# EAGLE board BEP33_6panel (EAGLE 7.7.0), part 1 of 4
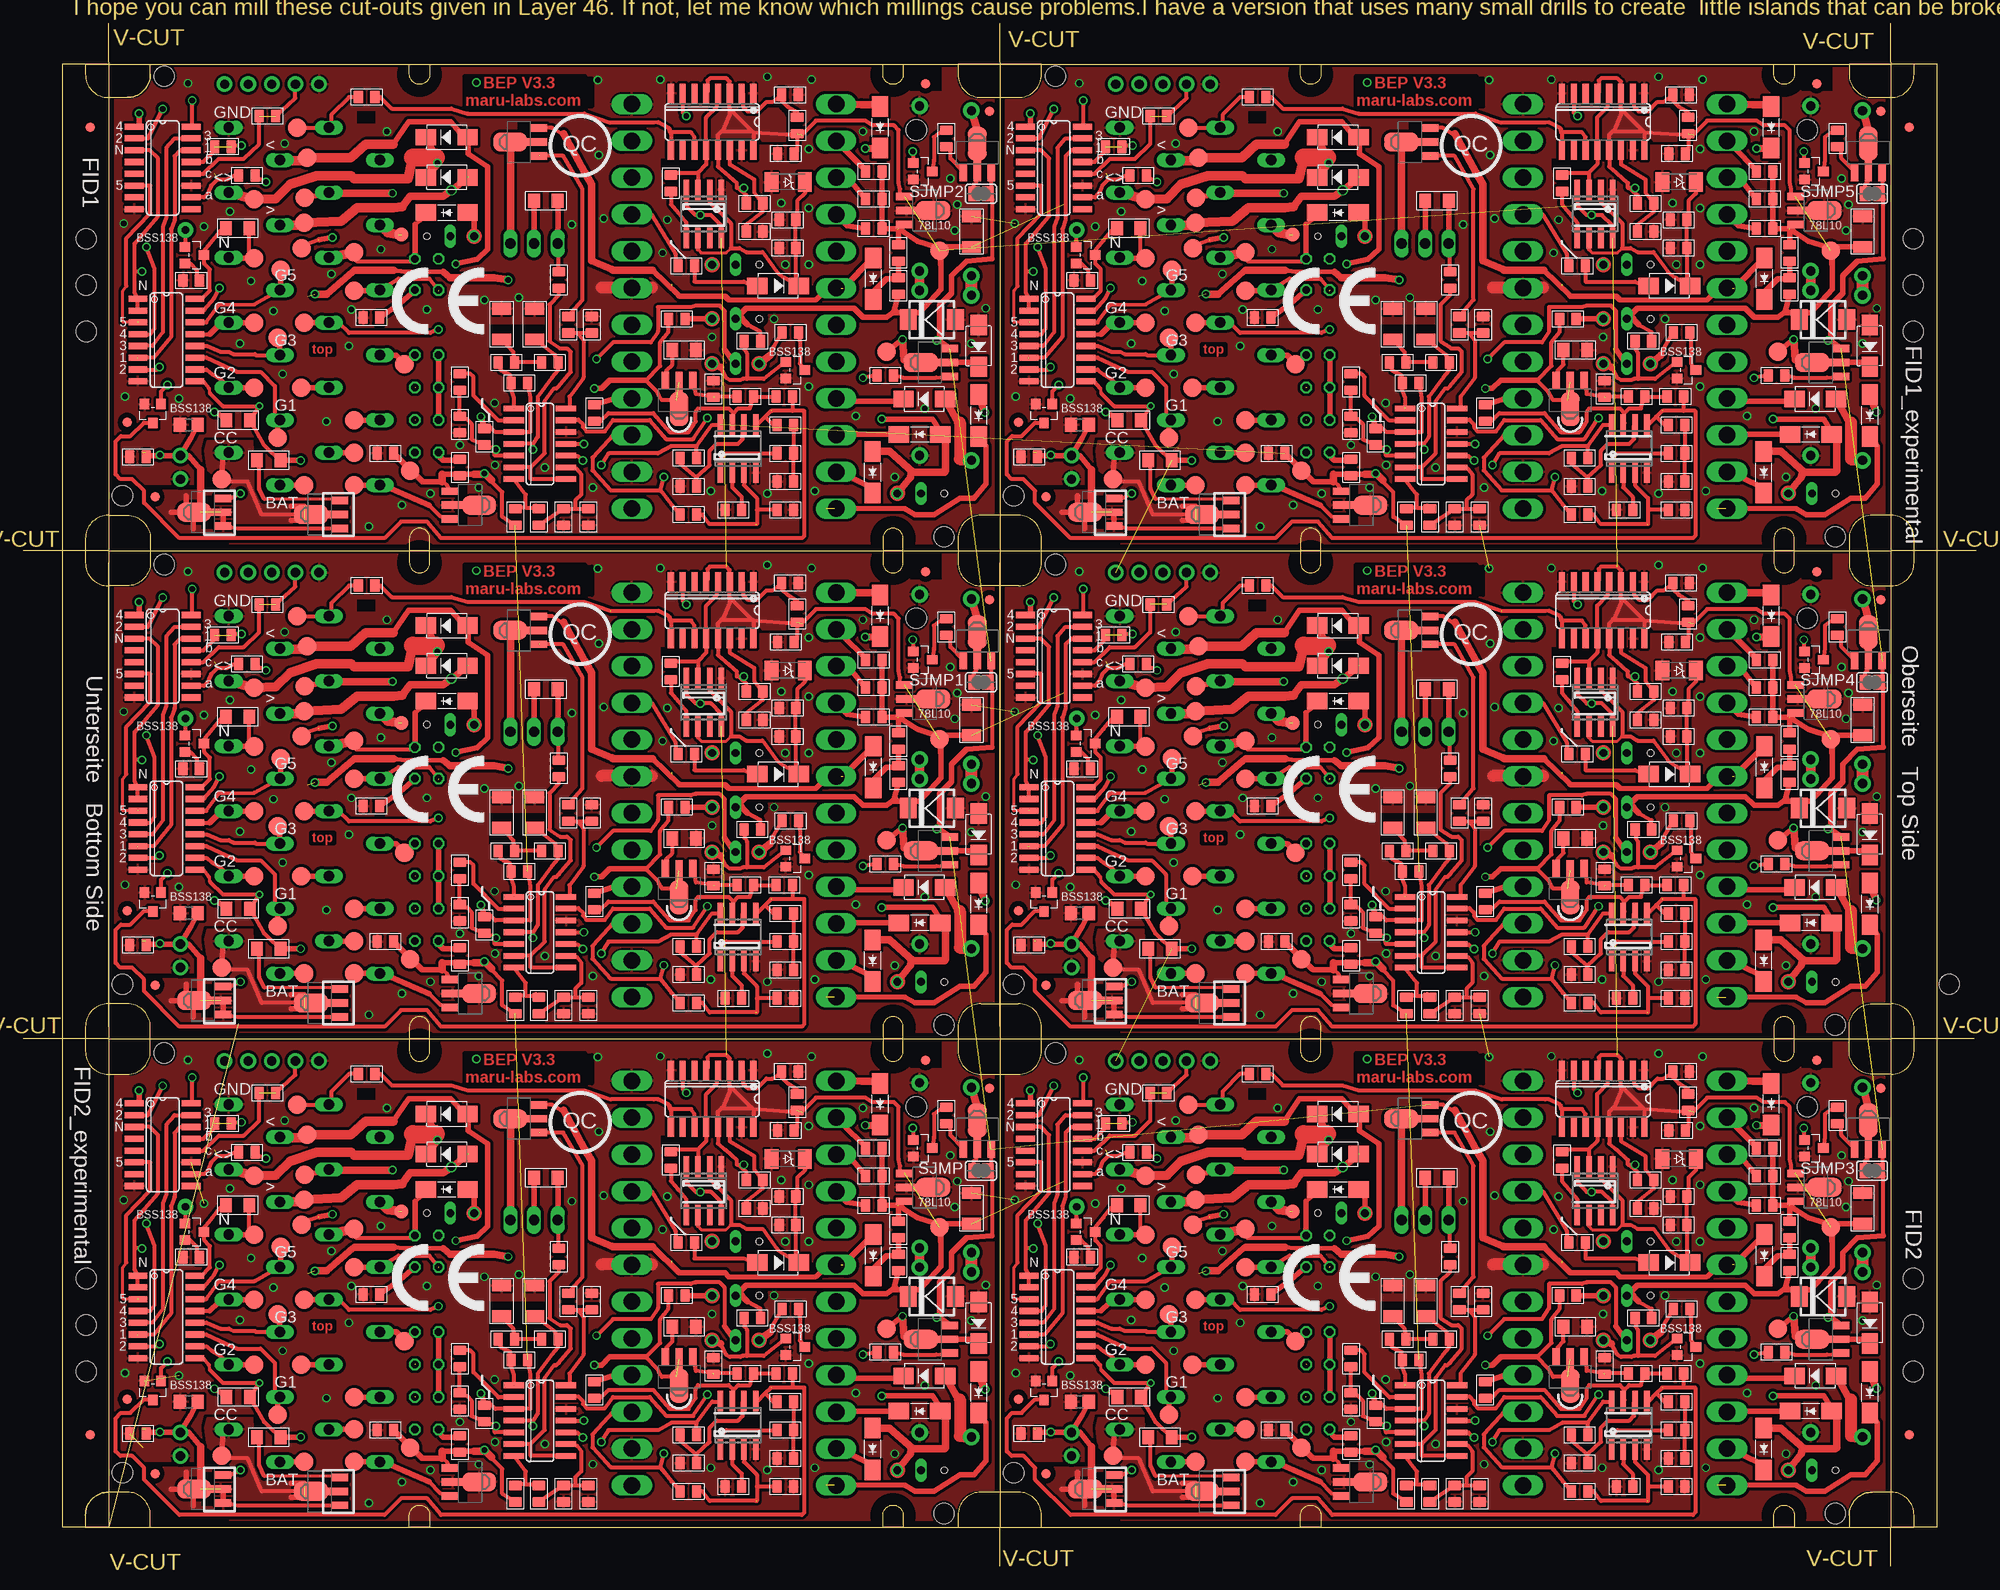
[diagram p13: board, top side]
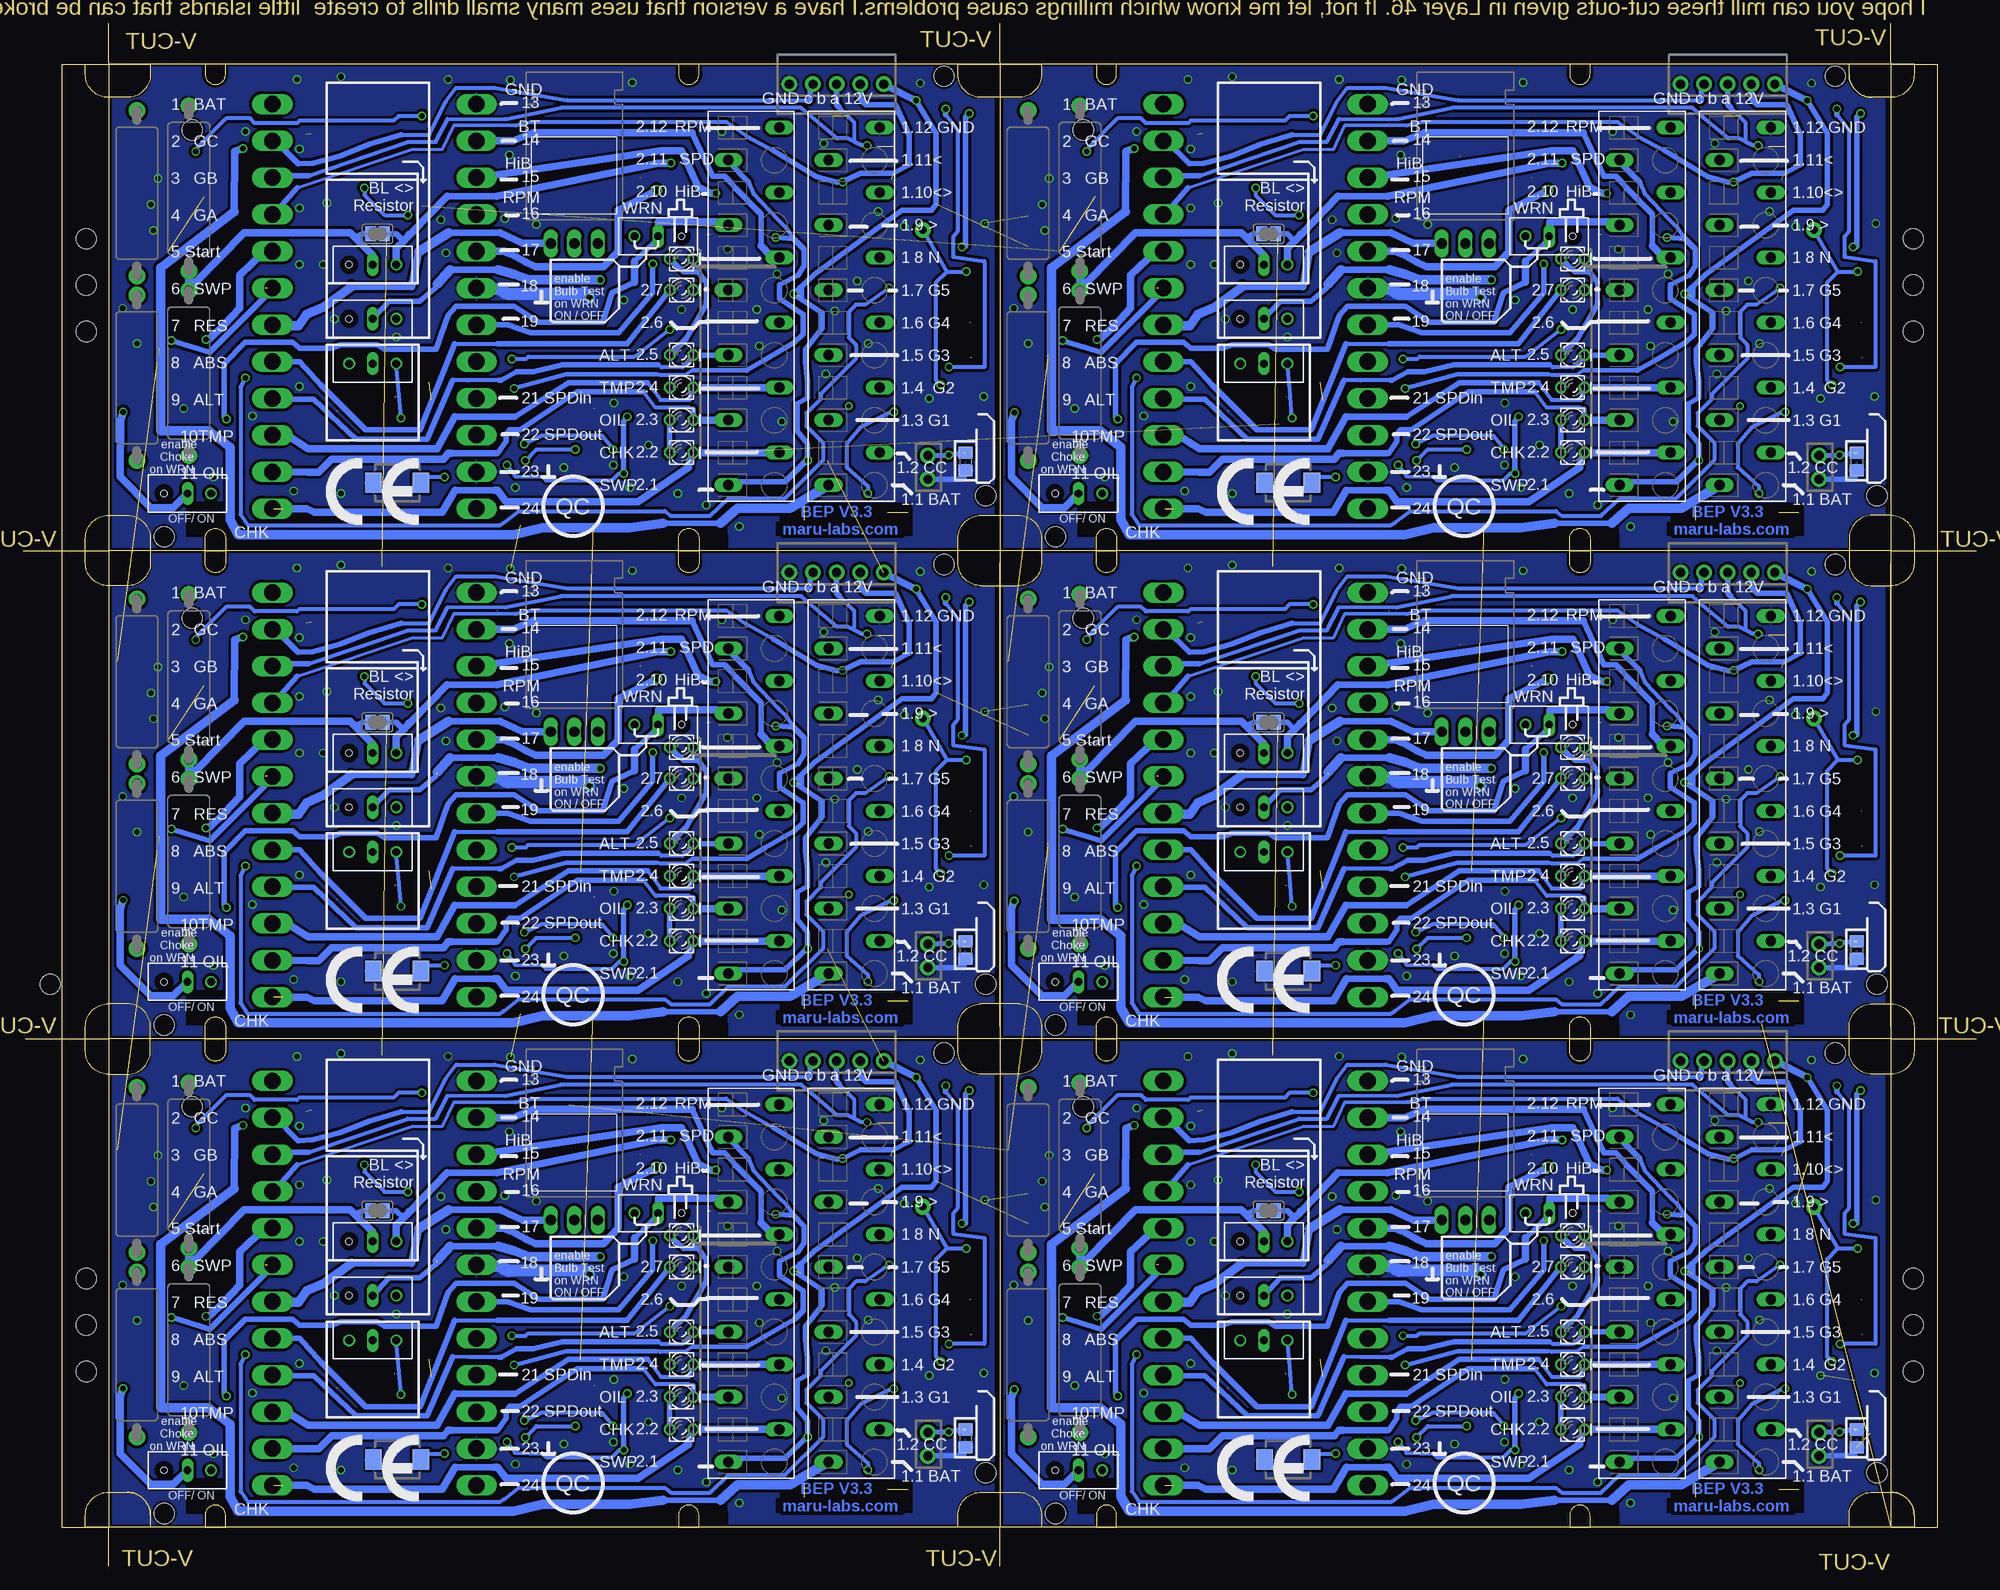
[diagram p14: board, bottom side, seen from below]

Size 210.4 x 166.2 mm. Coordinates in mm from the lower left corner, seen from the top.
Outline: 46 segments
Copper layers (1*16): Top 0.035mm / dielectric 1.5mm / Bottom 0.035mm
Design rules "Vorlage BEP3 und hoeher multi-cb_035um-cu": minimum track width 6mil, minimum drill 12mil, track to track 12mil, track to pad 12mil, pad to pad 6mil, via to via 6mil, smd to smd 6mil, copper to edge 10mil, drill to drill 8mil, minimum pad ring 8mil, minimum via ring 6mil, stop-mask expansion 3mil, vias tented up to drill 0mil, thermal gap 8mil
Holes 2.18 mm at 10.7,10.1 96.2,49.5 99.2,5.7 15.2,55.3 6.8,143 6.8,21 6.8,26 6.8,138 207.5,62.7 203.6,143 203.6,21 203.6,26 203.6,138 6.8,31 6.8,133 203.6,133 203.6,31 10.7,62.7 96.2,102.1 99.2,58.3 15.2,107.9 10.7,115.3 96.2,154.7 99.2,110.9 15.2,160.5 106.7,10.1 192.2,49.5 195.2,5.7 111.2,55.3 106.7,62.7 192.2,102.1 195.2,58.3 111.2,107.9 106.7,115.3 192.2,154.7 195.2,110.9 111.2,160.5
tRestrict: area 50.2,25.2 to 56.7,28.5; area 36,50.2 to 37.9,51.5; area 67.6,20.8 to 69.4,22.8; area 53.3,46.1 to 54.7,50.4; area 46.5,6.9 to 47.8,11.4; area 19.2,6.6 to 20.6,10.1; area 97.6,26.6 to 99.2,27.8; area 95.6,53.7 to 98.9,56.4; area 68.7,45.2 to 72.9,46.4; area 22.6,38.2 to 23.7,39.9; area 16.5,56.8 to 91.2,56.8; area 47.6,52 to 61.3,55.1; 96 more areas
bRestrict: area 18.6,5.8 to 28.8,9.3; area 28.7,5.8 to 33.3,7.3; area 38.5,5.1 to 45,7.3; area 90.8,5.7 to 96.8,9.5; area 41.5,54.3 to 43.9,56.7; area 41.3,55.4 to 44.1,56.8; area 92.5,54.3 to 94.9,56.7; area 92.3,55.4 to 95.1,56.8; area 92.4,4.2 to 95,6.8; area 41.4,4.2 to 44,6.9; area 38.5,4.2 to 45.6,5.9; area 100.8,53.1 to 105,56.8; 72 more areas
Milling: 188 lines

## Footprints (pad centres in the part's own frame; a part is rotated, then mirrored left to right if it is on the bottom)
12-PIN = drill 1.118 long: 1 19.25,-2.45; 2 15.75,3.05; 3 12.25,-2.45; 4 8.75,3.05; 5 5.25,-2.45; 6 1.75,3.05; 7 -1.75,-2.45; 8 -5.25,3.05; 9 -8.75,-2.45; 10 -12.25,3.05; 11 -15.75,-2.45; 12 -19.25,3.05
B2.0 = smd 2 x 2: TP 0,0
C1206 = smd 1.27 x 2.032: 1 -1.651,0; 2 1.651,0
C0805 = smd 1.397 x 1.016: 1 0,0.889; 2 0,-0.889
DO-214AC_SLIM = smd 2.2 x 1.77: 1 -2.242,0; 2 2.242,0
DO-214AC = smd 2.2 x 1.77: 1 -2.242,0; 2 2.242,0
SOD-123_MINI-SMA = smd 1.5 x 2.1: A 1.8,0; C -1.8,0
DO214AA = smd 1.8 x 2.2: A 2.55,0; C -2.55,0
DO214AA_BI = smd 1.8 x 2.2: A 2.45,0; C -2.65,0
FIDUCIAL_1MM = smd 1 x 1: 1 0,0
FIDUCIAL_1MM_WITH_SOLDERMASK = smd 1 x 1: 1 0,0
SO16 = smd 0.66 x 2.032: 1 -4.445,-3.073; 2 -3.175,-3.073; 3 -1.905,-3.073; 4 -0.635,-3.073; 5 0.635,-3.073; 6 1.905,-3.073; 7 3.175,-3.073; 8 4.445,-3.073; 9 4.445,3.073; 10 3.175,3.073; 11 1.905,3.073; 12 0.635,3.073; 13 -0.635,3.073; 14 -1.905,3.073; 15 -3.175,3.073; 16 -4.445,3.073
TO220H_NOHOLE = drill 1.118 long: 1 -2.54,-10.16; 2 0,-10.16; 3 2.54,-10.16
SO14 = smd 0.6 x 2.2: 1 -3.81,-2.8; 2 -2.54,-2.8; 3 -1.27,-2.8; 4 0,-2.8; 5 1.27,-2.8; 6 2.54,-2.8; 7 3.81,-2.8; 8 3.81,2.8; 9 2.54,2.8; 10 1.27,2.8; 11 0,2.8; 12 -1.27,2.8; 13 -2.54,2.8; 14 -3.81,2.8
SOT89_ROUND = smd 0.8 x 1.8: 1 -1.499,-2.181; 3 1.499,-2.181 | smd 0.8 x 2.3: 2 0,-1.927 | smd 2.032 x 3.65: 2@1 0,0.94
SO08 = smd 0.6 x 2.2: 1 -1.905,-2.6; 2 -0.635,-2.6; 3 0.635,-2.6; 4 1.905,-2.6; 5 1.905,2.6; 6 0.635,2.6; 7 -0.635,2.6; 8 -1.905,2.6
JP2_SMALLPADS = drill 0.85: 1 -2.54,0 | drill 0.85 long: 2 0,0 | hole 0.7: 2.54,0
JP2_ORIG_SMALLPADS = drill 0.85: 1 -2.54,0; 3 2.54,0 | drill 0.85 long: 2 0,0
LD260 = drill 0.813 octagon: A -1.27,0; K 1.27,0
SOT-23 = smd 1.016 x 1.143: 1 -0.889,-1.016; 2 0.889,-1.016; 3 0,1.016
SOT89 = smd 0.8 x 1.8: 1 -1.499,-2.181; 3 1.499,-2.181 | smd 0.8 x 2.3: 2 0,-1.927 | smd 2.032 x 3.65: 2@1 0,0.94
R0805 = smd 1.397 x 1.016: 1 0,0.889; 2 0,-0.889
R1206 = smd 1.27 x 1.524: 1 -1.27,0; 2 1.27,0
V235/17_1MM = drill 1 pad 1.778: 1 -8.89,0; 2 8.89,0
R0805' = smd 1.3 x 1.5: 1 -0.95,0; 2 0.95,0
SJ = smd 1.2 x 1.6: 1 -0.725,0; 2 0.725,0
SJ' = smd 1.168 x 1.6: 1 -0.762,0; 2 0.762,0
B1,27 = smd 1.5 x 1.5: TP 0,0
24-PIN_V2 = drill 1.778 long: 1 -21.78,-11; 2 -17.82,-11; 3 -13.86,-11; 4 -9.9,-11; 5 -5.94,-11; 6 -1.98,-11; 7 1.98,-11; 8 5.94,-11; 9 9.9,-11; 10 13.86,-11; 11 17.82,-11; 12 21.78,-11; 13 -21.78,11; 14 -17.82,11; 15 -13.86,11; 16 -9.9,11; 17 -5.94,11; 18 -1.98,11; 19 1.98,11; 20 5.94,11; 21 9.9,11; 22 13.86,11; 23 17.82,11; 24 21.78,11
22-23-2051 = drill 1 pad 1.676: 1 -5.08,0; 2 -2.54,0; 3 0,0; 4 2.54,0; 5 5.08,0
22-23-2021 = drill 1 pad 1.676: 1 -1.27,0; 2 1.27,0

## Placement (x,y rotation side)
1  [12-PIN]  25.19,30.5 270 bottom
2  [12-PIN]  35.98,30.5 270 bottom
3  [12-PIN]  25.19,83.1 270 bottom
4  [12-PIN]  35.98,83.1 270 bottom
5  [12-PIN]  25.19,135.7 270 bottom
6  [12-PIN]  35.98,135.7 270 bottom
6V  TPSB2.0  [B2.0]  41.7,12.78 0 top
6V1  TPSB2.0  [B2.0]  41.7,65.38 0 top
6V2  TPSB2.0  [B2.0]  41.7,117.98 0 top
6V3  TPSB2.0  [B2.0]  137.7,12.78 0 top
6V4  TPSB2.0  [B2.0]  137.7,65.38 0 top
6V5  TPSB2.0  [B2.0]  137.7,117.98 0 top
7  [12-PIN]  121.19,30.5 270 bottom
8  [12-PIN]  131.98,30.5 270 bottom
9  [12-PIN]  121.19,83.1 270 bottom
10  [12-PIN]  131.98,83.1 270 bottom
10V  TPSB2.0  [B2.0]  98.7,36.5 0 top
10V1  TPSB2.0  [B2.0]  98.7,89.1 0 top
10V2  TPSB2.0  [B2.0]  98.7,141.7 0 top
10V3  TPSB2.0  [B2.0]  194.7,36.5 0 top
10V4  TPSB2.0  [B2.0]  194.7,89.1 0 top
10V5  TPSB2.0  [B2.0]  194.7,141.7 0 top
11  [12-PIN]  121.19,135.7 270 bottom
12  [12-PIN]  131.98,135.7 270 bottom
C1  100u  [C1206]  51.54,81.19 90 top
C2  10u  [C1206]  102.16,38.56 90 top
C3  100u  [C1206]  55.1,81.19 90 top
C4  100nF,  [C0805]  39.03,67.28 270 top
C5  4.7u  [C0805]  82.1,61.19 90 top
C6  100nF.  [C0805]  58.21,60.43 0 top
C7  100nF.  [C0805]  61.26,81.13 0 top
C8  2.2nF  [C0805]  82.34,89.38 90 top
C9  100nF  [C0805]  82.16,99.55 270 top
C10  100nF  [C0805]  78.78,91.16 90 top
C11  100nF,  [C0805]  82.1,64.24 270 top
C12  4.7u  [C0805]  82.61,105.89 270 top
C13  10u  [C1206]  102.16,91.16 90 top
C14  100u  [C1206]  51.54,133.79 90 top
C15  4.7u  [C0805]  82.61,53.29 270 top
C16  100u  [C1206]  55.1,133.79 90 top
C17  100nF,  [C0805]  39.03,119.88 270 top
C18  4.7u  [C0805]  82.1,113.79 90 top
C19  100nF.  [C0805]  58.21,113.03 0 top
C20  100nF.  [C0805]  61.26,133.73 0 top
C21  2.2nF  [C0805]  82.34,141.98 90 top
C22  100nF  [C0805]  82.16,152.15 270 top
C23  100nF  [C0805]  78.78,143.76 90 top
C24  100nF,  [C0805]  82.1,116.84 270 top
C25  4.7u  [C0805]  82.61,158.49 270 top
C26  10u  [C1206]  102.16,143.76 90 top
C27  100u  [C1206]  147.54,28.59 90 top
C28  100u  [C1206]  151.1,28.59 90 top
C29  100nF,  [C0805]  135.03,14.68 270 top
C30  4.7u  [C0805]  178.1,8.59 90 top
C31  100nF.  [C0805]  154.21,7.83 0 top
C32  100nF.  [C0805]  157.26,28.53 0 top
C33  2.2nF  [C0805]  178.34,36.78 90 top
C34  100nF  [C0805]  178.16,46.95 270 top
C35  100nF  [C0805]  174.78,38.56 90 top
C36  100nF,  [C0805]  178.1,11.64 270 top
C37  4.7u  [C0805]  178.61,53.29 270 top
C38  10u  [C1206]  198.16,38.56 90 top
C39  100u  [C1206]  147.54,81.19 90 top
C40  100u  [C1206]  151.1,81.19 90 top
C41  100nF,  [C0805]  135.03,67.28 270 top
C42  4.7u  [C0805]  178.1,61.19 90 top
C43  100nF.  [C0805]  154.21,60.43 0 top
C44  100nF.  [C0805]  157.26,81.13 0 top
C45  2.2nF  [C0805]  178.34,89.38 90 top
C46  100nF  [C0805]  178.16,99.55 270 top
C47  100nF  [C0805]  174.78,91.16 90 top
C48  100nF,  [C0805]  178.1,64.24 270 top
C49  4.7u  [C0805]  178.61,105.89 270 top
C50  10u  [C1206]  198.16,91.16 90 top
C51  100u  [C1206]  147.54,133.79 90 top
C52  100u  [C1206]  151.1,133.79 90 top
C53  100nF,  [C0805]  135.03,119.88 270 top
C54  4.7u  [C0805]  178.1,113.79 90 top
C55  100nF.  [C0805]  154.21,113.03 0 top
C56  100nF.  [C0805]  157.26,133.73 0 top
C57  2.2nF  [C0805]  178.34,141.98 90 top
C58  100nF  [C0805]  178.16,152.15 270 top
C59  100nF  [C0805]  174.78,143.76 90 top
C60  100nF,  [C0805]  178.1,116.84 270 top
C61  4.7u  [C0805]  178.61,158.49 270 top
C62  10u  [C1206]  198.16,143.76 90 top
C101  4.7u  [C0805]  82.1,8.59 90 top
C102  100nF  [C0805]  82.16,46.95 270 top
C103  100nF,  [C0805]  82.1,11.64 270 top
C104  100nF,  [C0805]  39.03,14.68 270 top
C105  100nF.  [C0805]  58.21,7.83 0 top
C106  100nF.  [C0805]  61.26,28.53 0 top
C107  100u  [C1206]  51.54,28.59 90 top
C108  100u  [C1206]  55.1,28.59 90 top
C109  2.2nF  [C0805]  82.34,36.78 90 top
C110  100nF  [C0805]  78.78,38.56 90 top
D1  SS12  [DO-214AC_SLIM]  91.56,33.49 270 top
D2  SS12  [DO-214AC_SLIM]  92.3,49.78 270 top
D3  1N4007,  [DO-214AC]  45.64,97 180 top
D4  Zen11  [SOD-123_MINI-SMA]  82.4,43.88 180 top
D5  1N4007,  [DO-214AC]  45.64,101.32 180 top
D6  1N4007.  [DO-214AC]  97.07,73.13 180 top
D7  1N5817  [DO-214AC_SLIM]  96.56,69.32 180 top
D8  1N5817.  [DO-214AC_SLIM]  91.5,65.24 270 top
D9  1N5817.  [DO-214AC_SLIM]  102.93,71.35 270 top
D10  1N5817  [DO-214AC_SLIM]  45.64,93.19 180 top
D11  1N4007.  [DO-214AC]  102.93,78.84 270 top
D12  1N4007  [DO-214AC]  81.32,85.32 0 top
D13  Zen15  [DO214AA]  97.89,81.67 0 top
D14  SM6TDO214AA_BI  [DO214AA_BI]  74.21,64.11 180 bottom
D15  SS12  [DO-214AC_SLIM]  91.56,86.09 270 top
D16  SS12  [DO-214AC_SLIM]  92.3,102.38 270 top
D17  Zen11  [SOD-123_MINI-SMA]  82.4,96.48 180 top
D18  1N4007,  [DO-214AC]  45.64,149.6 180 top
D19  1N4007,  [DO-214AC]  45.64,153.92 180 top
D20  1N4007.  [DO-214AC]  97.07,125.73 180 top
D21  1N5817  [DO-214AC_SLIM]  96.56,121.92 180 top
D22  1N5817.  [DO-214AC_SLIM]  91.5,117.84 270 top
D23  1N5817.  [DO-214AC_SLIM]  102.93,123.95 270 top
D24  1N5817  [DO-214AC_SLIM]  45.64,145.79 180 top
D25  1N4007.  [DO-214AC]  102.93,131.44 270 top
D26  1N4007  [DO-214AC]  81.32,137.92 0 top
D27  Zen15  [DO214AA]  97.89,134.27 0 top
D28  SM6TDO214AA_BI  [DO214AA_BI]  74.21,116.71 180 bottom
D29  SS12  [DO-214AC_SLIM]  91.56,138.69 270 top
D30  SS12  [DO-214AC_SLIM]  92.3,154.98 270 top
D31  Zen11  [SOD-123_MINI-SMA]  82.4,149.08 180 top
D32  1N4007,  [DO-214AC]  141.64,44.4 180 top
D33  1N4007,  [DO-214AC]  141.64,48.72 180 top
D34  1N4007.  [DO-214AC]  193.07,20.53 180 top
D35  1N5817  [DO-214AC_SLIM]  192.56,16.72 180 top
D36  1N5817.  [DO-214AC_SLIM]  187.5,12.64 270 top
D37  1N5817.  [DO-214AC_SLIM]  198.93,18.75 270 top
D38  1N5817  [DO-214AC_SLIM]  141.64,40.59 180 top
D39  1N4007.  [DO-214AC]  198.93,26.24 270 top
D40  1N4007  [DO-214AC]  177.32,32.72 0 top
D41  Zen15  [DO214AA]  193.89,29.07 0 top
D42  SM6TDO214AA_BI  [DO214AA_BI]  170.21,11.51 180 bottom
D43  SS12  [DO-214AC_SLIM]  187.56,33.49 270 top
D44  SS12  [DO-214AC_SLIM]  188.3,49.78 270 top
D45  Zen11  [SOD-123_MINI-SMA]  178.4,43.88 180 top
D46  1N4007,  [DO-214AC]  141.64,97 180 top
D47  1N4007,  [DO-214AC]  141.64,101.32 180 top
D48  1N4007.  [DO-214AC]  193.07,73.13 180 top
D49  1N5817  [DO-214AC_SLIM]  192.56,69.32 180 top
D50  1N5817.  [DO-214AC_SLIM]  187.5,65.24 270 top
D51  1N5817.  [DO-214AC_SLIM]  198.93,71.35 270 top
D52  1N5817  [DO-214AC_SLIM]  141.64,93.19 180 top
D53  1N4007.  [DO-214AC]  198.93,78.84 270 top
D54  1N4007  [DO-214AC]  177.32,85.32 0 top
D55  Zen15  [DO214AA]  193.89,81.67 0 top
D56  SM6TDO214AA_BI  [DO214AA_BI]  170.21,64.11 180 bottom
D57  SS12  [DO-214AC_SLIM]  187.56,86.09 270 top
D58  SS12  [DO-214AC_SLIM]  188.3,102.38 270 top
D59  Zen11  [SOD-123_MINI-SMA]  178.4,96.48 180 top
D60  1N4007,  [DO-214AC]  141.64,149.6 180 top
D61  1N4007,  [DO-214AC]  141.64,153.92 180 top
D62  1N4007.  [DO-214AC]  193.07,125.73 180 top
D63  1N5817  [DO-214AC_SLIM]  192.56,121.92 180 top
D64  1N5817.  [DO-214AC_SLIM]  187.5,117.84 270 top
D65  1N5817.  [DO-214AC_SLIM]  198.93,123.95 270 top
D66  1N5817  [DO-214AC_SLIM]  141.64,145.79 180 top
D67  1N4007.  [DO-214AC]  198.93,131.44 270 top
D68  1N4007  [DO-214AC]  177.32,137.92 0 top
D69  Zen15  [DO214AA]  193.89,134.27 0 top
D70  SM6TDO214AA_BI  [DO214AA_BI]  170.21,116.71 180 bottom
D71  SS12  [DO-214AC_SLIM]  187.56,138.69 270 top
D72  SS12  [DO-214AC_SLIM]  188.3,154.98 270 top
D73  Zen11  [SOD-123_MINI-SMA]  178.4,149.08 180 top
D101  Zen15  [DO214AA]  97.89,29.07 0 top
D102  1N4007,  [DO-214AC]  45.64,44.4 180 top
D103  1N4007,  [DO-214AC]  45.64,48.72 180 top
D104  SM6TDO214AA_BI  [DO214AA_BI]  74.21,11.51 180 bottom
D105  1N4007.  [DO-214AC]  102.93,26.24 270 top
D106  1N4007.  [DO-214AC]  97.07,20.53 180 top
D107  1N5817  [DO-214AC_SLIM]  96.56,16.72 180 top
D108  1N5817.  [DO-214AC_SLIM]  91.5,12.64 270 top
D109  1N5817.  [DO-214AC_SLIM]  102.93,18.75 270 top
D110  1N5817  [DO-214AC_SLIM]  45.64,40.59 180 top
D112  1N4007  [DO-214AC]  81.32,32.72 0 top
FID1  FIDUCIAL  [FIDUCIAL_1MM]  7.2,155 0 top
FID1B  FIDUCIALFIDUCIAL_1MM_WITH_SOLDERMASK  [FIDUCIAL_1MM_WITH_SOLDERMASK]  203.2,155 0 top
FID2  FIDUCIAL  [FIDUCIAL_1MM]  203.2,14.2 0 top
FID2B  FIDUCIALFIDUCIAL_1MM_WITH_SOLDERMASK  [FIDUCIAL_1MM_WITH_SOLDERMASK]  7.2,14.2 0 top
FID3  FIDUCIAL  [FIDUCIAL_1MM]  97.2,107.1 0 top
FID4  FIDUCIAL  [FIDUCIAL_1MM]  11.2,70.6 0 top
FID5  FIDUCIAL  [FIDUCIAL_1MM]  14.2,62.6 0 top
FID6  FIDUCIAL  [FIDUCIAL_1MM]  104.1,104.1 0 top
FID7  FIDUCIAL  [FIDUCIAL_1MM]  97.2,159.7 0 top
FID8  FIDUCIAL  [FIDUCIAL_1MM]  11.2,123.2 0 top
FID9  FIDUCIAL  [FIDUCIAL_1MM]  14.2,115.2 0 top
FID10  FIDUCIAL  [FIDUCIAL_1MM]  104.1,156.7 0 top
FID11  FIDUCIAL  [FIDUCIAL_1MM]  193.2,54.5 0 top
FID12  FIDUCIAL  [FIDUCIAL_1MM]  107.2,18 0 top
FID13  FIDUCIAL  [FIDUCIAL_1MM]  110.2,10 0 top
FID14  FIDUCIAL  [FIDUCIAL_1MM]  200.1,51.5 0 top
FID15  FIDUCIAL  [FIDUCIAL_1MM]  193.2,107.1 0 top
FID16  FIDUCIAL  [FIDUCIAL_1MM]  107.2,70.6 0 top
FID17  FIDUCIAL  [FIDUCIAL_1MM]  110.2,62.6 0 top
FID18  FIDUCIAL  [FIDUCIAL_1MM]  200.1,104.1 0 top
FID19  FIDUCIAL  [FIDUCIAL_1MM]  193.2,159.7 0 top
FID20  FIDUCIAL  [FIDUCIAL_1MM]  107.2,123.2 0 top
FID21  FIDUCIAL  [FIDUCIAL_1MM]  110.2,115.2 0 top
FID22  FIDUCIAL  [FIDUCIAL_1MM]  200.1,156.7 0 top
FID101  FIDUCIAL  [FIDUCIAL_1MM]  97.2,54.5 0 top
FID102  FIDUCIAL  [FIDUCIAL_1MM]  11.2,18 0 top
FID103  FIDUCIAL  [FIDUCIAL_1MM]  14.2,10 0 top
FID104  FIDUCIAL  [FIDUCIAL_1MM]  104.1,51.5 0 top
IC1  4028  [SO16]  15.03,98.02 270 top
IC2  317TO202H_NOHOLE  [TO220H_NOHOLE]  55.03,100.05 0 bottom
IC3  ULN2004  [SO16]  15.43,79.48 270 top
IC4  LM339  [SO14]  55.67,68.3 270 top
IC5  78L06  [SOT89_ROUND]  48.18,61.7 270 top
IC6  555  [SO08]  73.32,93.06 180 top
IC7  4538  [SO16]  74.21,102.97 180 top
IC8  78L10  [SOT89_ROUND]  97.11,93.42 270 top
IC9  LM2904  [SO08]  77.01,67.79 0 top
IC10  4028  [SO16]  15.03,150.62 270 top
IC11  317TO202H_NOHOLE  [TO220H_NOHOLE]  55.03,152.65 0 bottom
IC12  ULN2004  [SO16]  15.43,132.08 270 top
IC13  LM339  [SO14]  55.67,120.9 270 top
IC14  78L06  [SOT89_ROUND]  48.18,114.3 270 top
IC15  555  [SO08]  73.32,145.66 180 top
IC16  4538  [SO16]  74.21,155.57 180 top
IC17  78L10  [SOT89_ROUND]  97.11,146.02 270 top
IC18  LM2904  [SO08]  77.01,120.39 0 top
IC19  4028  [SO16]  111.03,45.42 270 top
IC20  317TO202H_NOHOLE  [TO220H_NOHOLE]  151.03,47.45 0 bottom
IC21  ULN2004  [SO16]  111.43,26.88 270 top
IC22  LM339  [SO14]  151.67,15.7 270 top
IC23  78L06  [SOT89_ROUND]  144.18,9.1 270 top
IC24  555  [SO08]  169.32,40.47 180 top
IC25  4538  [SO16]  170.21,50.37 180 top
IC26  78L10  [SOT89_ROUND]  193.11,40.82 270 top
IC27  LM2904  [SO08]  173.01,15.19 0 top
IC28  4028  [SO16]  111.03,98.02 270 top
IC29  317TO202H_NOHOLE  [TO220H_NOHOLE]  151.03,100.05 0 bottom
IC30  ULN2004  [SO16]  111.43,79.48 270 top
IC31  LM339  [SO14]  151.67,68.3 270 top
IC32  78L06  [SOT89_ROUND]  144.18,61.7 270 top
IC33  555  [SO08]  169.32,93.06 180 top
IC34  4538  [SO16]  170.21,102.97 180 top
IC35  78L10  [SOT89_ROUND]  193.11,93.42 270 top
IC36  LM2904  [SO08]  173.01,67.79 0 top
IC37  4028  [SO16]  111.03,150.62 270 top
IC38  317TO202H_NOHOLE  [TO220H_NOHOLE]  151.03,152.65 0 bottom
IC39  ULN2004  [SO16]  111.43,132.08 270 top
IC40  LM339  [SO14]  151.67,120.9 270 top
IC41  78L06  [SOT89_ROUND]  144.18,114.3 270 top
IC42  555  [SO08]  169.32,145.66 180 top
IC43  4538  [SO16]  170.21,155.57 180 top
IC44  78L10  [SOT89_ROUND]  193.11,146.02 270 top
IC45  LM2904  [SO08]  173.01,120.39 0 top
IC101  LM2904  [SO08]  77.01,15.19 0 top
IC102  78L06  [SOT89_ROUND]  48.18,9.1 270 top
IC104  78L10  [SOT89_ROUND]  97.11,40.82 270 top
IC105  4028  [SO16]  15.03,45.42 270 top
IC107  ULN2004  [SO16]  15.43,26.88 270 top
IC108  LM339  [SO14]  55.67,15.7 270 top
IC109  317TO202H_NOHOLE  [TO220H_NOHOLE]  55.03,47.45 0 bottom
IC110  555  [SO08]  73.32,40.47 180 top
IC111  4538  [SO16]  74.21,50.37 180 top
JP1  [JP2_SMALLPADS]  76.75,81.76 180 bottom
JP2  JP2E_ORIG  [JP2_ORIG_SMALLPADS]  76.75,76.94 180 bottom
JP3  [JP2_SMALLPADS]  96.7,62.95 180 bottom
JP4  [JP2_SMALLPADS]  46.02,90.65 0 bottom
JP5  [JP2_SMALLPADS]  76.75,87.6 180 bottom
JP6  [JP2_SMALLPADS]  76.75,134.36 180 bottom
JP7  JP2E_ORIG  [JP2_ORIG_SMALLPADS]  76.75,129.54 180 bottom
JP8  [JP2_SMALLPADS]  96.7,115.55 180 bottom
JP9  [JP2_SMALLPADS]  46.02,143.25 0 bottom
JP10  [JP2_SMALLPADS]  76.75,140.2 180 bottom
JP11  [JP2_SMALLPADS]  172.75,29.16 180 bottom
JP12  JP2E_ORIG  [JP2_ORIG_SMALLPADS]  172.75,24.34 180 bottom
JP13  [JP2_SMALLPADS]  192.7,10.35 180 bottom
JP14  [JP2_SMALLPADS]  142.02,38.05 0 bottom
JP15  [JP2_SMALLPADS]  172.75,35 180 bottom
JP16  [JP2_SMALLPADS]  172.75,81.76 180 bottom
JP17  JP2E_ORIG  [JP2_ORIG_SMALLPADS]  172.75,76.94 180 bottom
JP18  [JP2_SMALLPADS]  192.7,62.95 180 bottom
JP19  [JP2_SMALLPADS]  142.02,90.65 0 bottom
JP20  [JP2_SMALLPADS]  172.75,87.6 180 bottom
JP21  [JP2_SMALLPADS]  172.75,134.36 180 bottom
JP22  JP2E_ORIG  [JP2_ORIG_SMALLPADS]  172.75,129.54 180 bottom
JP23  [JP2_SMALLPADS]  192.7,115.55 180 bottom
JP24  [JP2_SMALLPADS]  142.02,143.25 0 bottom
JP25  [JP2_SMALLPADS]  172.75,140.2 180 bottom
JP101  [JP2_SMALLPADS]  76.75,29.16 180 bottom
JP102  [JP2_SMALLPADS]  96.7,10.35 180 bottom
JP103  [JP2_SMALLPADS]  46.02,38.05 0 bottom
JP104  [JP2_SMALLPADS]  76.75,35 180 bottom
JP105  JP2E_ORIG  [JP2_ORIG_SMALLPADS]  76.75,24.34 180 bottom
LED1  [LD260]  43.48,67.35 0 bottom
LED2  [LD260]  43.48,70.85 0 bottom
LED3  [LD260]  43.48,74.35 0 bottom
LED4  [LD260]  43.48,77.85 0 bottom
LED5  [LD260]  43.48,84.85 0 bottom
LED6  [LD260]  43.48,88.22 0 bottom
LED7  [LD260]  43.48,119.95 0 bottom
LED8  [LD260]  43.48,123.45 0 bottom
LED9  [LD260]  43.48,126.95 0 bottom
LED10  [LD260]  43.48,130.45 0 bottom
LED11  [LD260]  43.48,137.45 0 bottom
LED12  [LD260]  43.48,140.82 0 bottom
LED13  [LD260]  139.48,14.75 0 bottom
LED14  [LD260]  139.48,18.25 0 bottom
LED15  [LD260]  139.48,21.75 0 bottom
LED16  [LD260]  139.48,25.25 0 bottom
LED17  [LD260]  139.48,32.25 0 bottom
LED18  [LD260]  139.48,35.62 0 bottom
LED19  [LD260]  139.48,67.35 0 bottom
LED20  [LD260]  139.48,70.85 0 bottom
LED21  [LD260]  139.48,74.35 0 bottom
LED22  [LD260]  139.48,77.85 0 bottom
LED23  [LD260]  139.48,84.85 0 bottom
LED24  [LD260]  139.48,88.22 0 bottom
LED25  [LD260]  139.48,119.95 0 bottom
LED26  [LD260]  139.48,123.45 0 bottom
LED27  [LD260]  139.48,126.95 0 bottom
LED28  [LD260]  139.48,130.45 0 bottom
LED29  [LD260]  139.48,137.45 0 bottom
LED30  [LD260]  139.48,140.82 0 bottom
LED101  [LD260]  43.48,32.25 0 bottom
LED102  [LD260]  43.48,14.75 0 bottom
LED103  [LD260]  43.48,18.25 0 bottom
LED104  [LD260]  43.48,21.75 0 bottom
LED105  [LD260]  43.48,25.25 0 bottom
LED106  [LD260]  43.48,35.62 0 bottom
Q1  J1  [SOT-23]  13.97,18.96 180 top
Q2  BA  [SOT89]  102.77,47.08 0 top
Q3  J1  [SOT-23]  96.9,45.05 270 top
Q4  BA  [SOT89]  97.64,77.06 90 top
Q5  BA.  [SOT89]  19.35,60.93 90 top
Q6  BA.  [SOT89]  31.93,60.68 90 top
Q7  BA  [SOT89]  53.38,100.81 90 top
Q8  MY  [SOT89]  70.66,73 180 top
Q9  J1  [SOT-23]  83.17,76.24 270 top
Q10  J1  [SOT-23]  18.46,88.62 270 top
Q11  J1  [SOT-23]  13.97,71.56 180 top
Q12  BA  [SOT89]  102.77,99.68 0 top
Q13  J1  [SOT-23]  96.9,97.65 270 top
Q14  BA  [SOT89]  97.64,129.66 90 top
Q15  BA.  [SOT89]  19.35,113.53 90 top
Q16  BA.  [SOT89]  31.93,113.28 90 top
Q17  BA  [SOT89]  53.38,153.41 90 top
Q18  MY  [SOT89]  70.66,125.6 180 top
Q19  J1  [SOT-23]  83.17,128.84 270 top
Q20  J1  [SOT-23]  18.46,141.22 270 top
Q21  J1  [SOT-23]  13.97,124.16 180 top
Q22  BA  [SOT89]  102.77,152.28 0 top
Q23  J1  [SOT-23]  96.9,150.25 270 top
Q24  BA  [SOT89]  193.64,24.46 90 top
Q25  BA.  [SOT89]  115.35,8.33 90 top
Q26  BA.  [SOT89]  127.93,8.08 90 top
Q27  BA  [SOT89]  149.38,48.21 90 top
Q28  MY  [SOT89]  166.66,20.4 180 top
Q29  J1  [SOT-23]  179.17,23.64 270 top
Q30  J1  [SOT-23]  114.46,36.02 270 top
Q31  J1  [SOT-23]  109.97,18.96 180 top
Q32  BA  [SOT89]  198.77,47.08 0 top
Q33  J1  [SOT-23]  192.9,45.05 270 top
Q34  BA  [SOT89]  193.64,77.06 90 top
Q35  BA.  [SOT89]  115.35,60.93 90 top
Q36  BA.  [SOT89]  127.93,60.68 90 top
Q37  BA  [SOT89]  149.38,100.81 90 top
Q38  MY  [SOT89]  166.66,73 180 top
Q39  J1  [SOT-23]  179.17,76.24 270 top
Q40  J1  [SOT-23]  114.46,88.62 270 top
Q41  J1  [SOT-23]  109.97,71.56 180 top
Q42  BA  [SOT89]  198.77,99.68 0 top
Q43  J1  [SOT-23]  192.9,97.65 270 top
Q44  BA  [SOT89]  193.64,129.66 90 top
Q45  BA.  [SOT89]  115.35,113.53 90 top
Q46  BA.  [SOT89]  127.93,113.28 90 top
Q47  BA  [SOT89]  149.38,153.41 90 top
Q48  MY  [SOT89]  166.66,125.6 180 top
Q49  J1  [SOT-23]  179.17,128.84 270 top
Q50  J1  [SOT-23]  114.46,141.22 270 top
Q51  J1  [SOT-23]  109.97,124.16 180 top
Q52  BA  [SOT89]  198.77,152.28 0 top
Q53  J1  [SOT-23]  192.9,150.25 270 top
Q101  BA.  [SOT89]  31.93,8.08 90 top
Q102  BA.  [SOT89]  19.35,8.33 90 top
Q103  MY  [SOT89]  70.66,20.4 180 top
Q104  BA  [SOT89]  97.64,24.46 90 top
Q105  BA  [SOT89]  53.38,48.21 90 top
Q106  J1  [SOT-23]  18.46,36.02 270 top
Q107  J1  [SOT-23]  83.17,23.64 270 top
R1  104  [R0805]  26.3,51 90 top
R2  104  [R0805]  21.5,47.7 90 top
R3  104  [R0805]  24.1,44.6 90 top
R4  100  [R0805]  18.1,33.3 90 top
R5  13  [R1206]  71.2,25.8 0 top
R6  2201  [R0805]  74.36,21.6 180 top
R7  47  [V235/17_1MM]  102.15,75.41 90 bottom
R8  4701  [R0805]  99.43,48.58 180 top
R9  13  [R1206]  23.1,38.9 0 top
R10  104  [R0805]  83.37,49.99 0 top
R11  13  [R1206]  56.3,94.46 180 top
R12  100  [R0805]  94.29,32.72 0 top
R13  100  [R0805]  94.29,36.27 180 top
R14  47  [V235/17_1MM]  102.15,95.29 90 bottom
R15  104  [R0805]  91.61,97.64 90 top
R16  104  [R0805]  91.61,94.65 90 top
R17  104  [R0805]  91.61,91.48 90 top
R18  4701  [R0805]  71.67,60.68 270 top
R19  1002  [R0805]  76.5,61.19 90 top
R20  1002  [R0805]  57.7,85.95 180 top
R21  1502  [R0805]  53,60.43 0 top
R22  104  [R0805]  52.05,77.06 270 top
R23  104  [R0805]  56.75,77.06 270 top
R24  1502  [R0805]  49.7,69.06 180 top
R25  1002  [R0805]  47.03,70.4 180 top
R26  2201  [R0805]  47.03,74.97 0 top
R27  1002  [R0805]  53.45,74.84 270 top
R28  4701  [R0805]  58.72,81.13 0 top
R29  2702  [R0805]  60.88,60.43 180 top
R30  102  [R0805]  12.36,66.9 270 top
R31  R_user  [R0805']  12.87,66.4 270 bottom
R32  102  [R0805]  61.51,71.6 0 top
R33  (101)  [R0805]  37.51,81.89 270 top
R34  (1000)  [R0805]  47.03,65.76 0 top
R35  102  [R0805]  92.88,75.67 90 top
R36  13  [R1206]  23.16,70.84 180 top
R37  13  [R1206]  26.46,66.52 180 top
R38  2702  [R0805]  55.54,60.43 0 top
R39  4701  [R0805]  77.81,73.38 270 top
R40  100  [R0805]  82.66,80.3 90 top
R41  104  [R0805]  78.53,79.35 270 top
R42  104  [R0805]  82.34,92.43 270 top
R43  (1002)  [R0805]  69.77,96.37 0 top
R44  2702  [R0805]  71.42,87.48 270 top
R45  47  [V235/17_1MM]  96.56,75.92 90 bottom
R46  47  [V235/17_1MM]  96.56,95.8 270 bottom
R47  2702  [R0805]  78.78,94.21 270 top
R48  2201  [R0805]  70.4,81.76 90 top
R49  1002  [R0805]  37,105.64 90 top
R50  1002  [R0805]  82.1,67.28 270 top
R51  102  [R0805]  82.1,70.33 270 top
R52  2702  [R0805]  81.98,73.38 90 top
R53  1002  [R0805]  71.67,66.78 90 top
R54  1002  [R0805]  71.67,63.73 90 top
R55  R_user  [R0805']  17.84,70.33 180 top
R56  104  [R0805]  26.3,103.6 90 top
R57  104  [R0805]  21.5,100.3 90 top
R58  104  [R0805]  24.1,97.2 90 top
R59  13  [R1206]  71.2,78.4 0 top
R60  2201  [R0805]  74.36,74.2 180 top
R61  100  [R0805]  18.1,85.9 90 top
R62  13  [R1206]  23.1,91.5 0 top
R63  4701  [R0805]  99.43,101.18 180 top
R64  104  [R0805]  83.37,102.59 0 top
R65  100  [R0805]  94.29,85.32 0 top
R66  100  [R0805]  94.29,88.87 180 top
R67  47  [V235/17_1MM]  102.15,128.01 90 bottom
R68  13  [R1206]  56.3,147.06 180 top
R69  47  [V235/17_1MM]  102.15,147.89 90 bottom
R70  104  [R0805]  91.61,150.24 90 top
R71  104  [R0805]  91.61,147.25 90 top
R72  104  [R0805]  91.61,144.08 90 top
R73  4701  [R0805]  71.67,113.28 270 top
R74  1002  [R0805]  76.5,113.79 90 top
R75  1002  [R0805]  57.7,138.55 180 top
R76  1502  [R0805]  53,113.03 0 top
R77  104  [R0805]  52.05,129.66 270 top
R78  104  [R0805]  56.75,129.66 270 top
R79  1502  [R0805]  49.7,121.66 180 top
R80  1002  [R0805]  47.03,123 180 top
R81  2201  [R0805]  47.03,127.57 0 top
R82  1002  [R0805]  53.45,127.44 270 top
R83  4701  [R0805]  58.72,133.73 0 top
R84  2702  [R0805]  60.88,113.03 180 top
R85  102  [R0805]  12.36,119.5 270 top
R86  R_user  [R0805']  12.87,119 270 bottom
R87  102  [R0805]  61.51,124.2 0 top
R88  (101)  [R0805]  37.51,134.49 270 top
R89  (1000)  [R0805]  47.03,118.36 0 top
R90  102  [R0805]  92.88,128.27 90 top
R91  13  [R1206]  23.16,123.44 180 top
R92  13  [R1206]  26.46,119.12 180 top
R93  2702  [R0805]  55.54,113.03 0 top
R94  4701  [R0805]  77.81,125.98 270 top
R95  100  [R0805]  82.66,132.9 90 top
R96  104  [R0805]  78.53,131.95 270 top
R97  104  [R0805]  82.34,145.03 270 top
R98  (1002)  [R0805]  69.77,148.97 0 top
R99  2702  [R0805]  71.42,140.08 270 top
R100  47  [V235/17_1MM]  96.56,128.52 90 bottom
R101  102  [R0805]  12.36,14.3 270 top
R102  13  [R1206]  26.46,13.92 180 top
R103  R_user  [R0805']  17.84,17.73 180 top
R104  R_user  [R0805']  12.87,13.79 270 bottom
R105  4701  [R0805]  71.67,8.08 270 top
R106  13  [R1206]  23.16,18.24 180 top
R107  1002  [R0805]  76.5,8.59 90 top
R108  1002  [R0805]  82.1,14.68 270 top
R109  104  [R0805]  91.61,45.04 90 top
R110  104  [R0805]  91.61,42.05 90 top
R111  104  [R0805]  91.61,38.88 90 top
R112  102  [R0805]  82.1,17.73 270 top
R113  1002  [R0805]  71.67,14.18 90 top
R114  1002  [R0805]  71.67,11.13 90 top
R115  102  [R0805]  61.51,19 0 top
R116  4701  [R0805]  77.81,20.78 270 top
R117  2702  [R0805]  81.98,20.78 90 top
R118  47  [V235/17_1MM]  96.56,148.4 270 bottom
R119  2201  [R0805]  70.4,29.16 90 top
R120  1002  [R0805]  57.7,33.35 180 top
R121  1502  [R0805]  53,7.83 0 top
R122  2702  [R0805]  55.54,7.83 0 top
R123  2702  [R0805]  60.88,7.83 180 top
R124  1002  [R0805]  53.45,22.24 270 top
R125  104  [R0805]  52.05,24.46 270 top
R126  4701  [R0805]  58.72,28.53 0 top
R127  47  [V235/17_1MM]  102.15,22.81 90 bottom
R128  102  [R0805]  92.88,23.07 90 top
R129  47  [V235/17_1MM]  102.15,42.69 90 bottom
R130  104  [R0805]  56.75,24.46 270 top
R131  1502  [R0805]  49.7,16.46 180 top
R132  1002  [R0805]  47.03,17.8 180 top
R133  2201  [R0805]  47.03,22.37 0 top
R134  13  [R1206]  56.3,41.86 180 top
R135  104  [R0805]  78.53,26.75 270 top
R136  47  [V235/17_1MM]  96.56,23.32 90 bottom
R137  47  [V235/17_1MM]  96.56,43.2 270 bottom
R138  100  [R0805]  82.66,27.7 90 top
R139  2702  [R0805]  78.78,146.81 270 top
R140  2702  [R0805]  71.42,34.88 270 top
R141  104  [R0805]  82.34,39.83 270 top
R142  (1000)  [R0805]  47.03,13.16 0 top
R143  (101)  [R0805]  37.51,29.29 270 top
R144  (1002)  [R0805]  69.77,43.77 0 top
R145  2702  [R0805]  78.78,41.61 270 top
R146  1002  [R0805]  37,53.04 90 top
R147  2201  [R0805]  70.4,134.36 90 top
R148  1002  [R0805]  37,158.24 90 top
R149  1002  [R0805]  82.1,119.88 270 top
R150  102  [R0805]  82.1,122.93 270 top
R151  2702  [R0805]  81.98,125.98 90 top
R152  1002  [R0805]  71.67,119.38 90 top
R153  1002  [R0805]  71.67,116.33 90 top
R154  R_user  [R0805']  17.84,122.93 180 top
R155  104  [R0805]  26.3,156.2 90 top
R156  104  [R0805]  21.5,152.9 90 top
R157  104  [R0805]  24.1,149.8 90 top
R158  13  [R1206]  71.2,131 0 top
R159  2201  [R0805]  74.36,126.8 180 top
R160  100  [R0805]  18.1,138.5 90 top
R161  13  [R1206]  23.1,144.1 0 top
R162  4701  [R0805]  99.43,153.78 180 top
R163  104  [R0805]  83.37,155.19 0 top
R164  100  [R0805]  94.29,137.92 0 top
R165  100  [R0805]  94.29,141.47 180 top
R166  47  [V235/17_1MM]  198.15,22.81 90 bottom
R167  13  [R1206]  152.3,41.86 180 top
R168  47  [V235/17_1MM]  198.15,42.69 90 bottom
R169  104  [R0805]  187.61,45.04 90 top
R170  104  [R0805]  187.61,42.05 90 top
R171  104  [R0805]  187.61,38.88 90 top
R172  4701  [R0805]  167.67,8.08 270 top
R173  1002  [R0805]  172.5,8.59 90 top
R174  1002  [R0805]  153.7,33.35 180 top
R175  1502  [R0805]  149,7.83 0 top
R176  104  [R0805]  148.05,24.46 270 top
R177  104  [R0805]  152.75,24.46 270 top
R178  1502  [R0805]  145.7,16.46 180 top
R179  1002  [R0805]  143.03,17.8 180 top
R180  2201  [R0805]  143.03,22.37 0 top
R181  1002  [R0805]  149.45,22.24 270 top
R182  4701  [R0805]  154.72,28.53 0 top
R183  2702  [R0805]  156.88,7.83 180 top
R184  102  [R0805]  108.36,14.3 270 top
R185  R_user  [R0805']  108.87,13.79 270 bottom
R186  102  [R0805]  157.51,19 0 top
R187  (101)  [R0805]  133.51,29.29 270 top
R188  (1000)  [R0805]  143.03,13.16 0 top
R189  102  [R0805]  188.88,23.07 90 top
R190  13  [R1206]  119.16,18.24 180 top
R191  13  [R1206]  122.46,13.92 180 top
R192  2702  [R0805]  151.54,7.83 0 top
R193  4701  [R0805]  173.81,20.78 270 top
R194  100  [R0805]  178.66,27.7 90 top
R195  104  [R0805]  174.53,26.75 270 top
R196  104  [R0805]  178.34,39.83 270 top
R197  (1002)  [R0805]  165.77,43.77 0 top
R198  2702  [R0805]  167.42,34.88 270 top
R199  47  [V235/17_1MM]  192.56,23.32 90 bottom
R200  47  [V235/17_1MM]  192.56,43.2 270 bottom
R201  2702  [R0805]  174.78,41.61 270 top
R202  2201  [R0805]  166.4,29.16 90 top
R203  1002  [R0805]  133,53.04 90 top
R204  1002  [R0805]  178.1,14.68 270 top
R205  102  [R0805]  178.1,17.73 270 top
R206  2702  [R0805]  177.98,20.78 90 top
R207  1002  [R0805]  167.67,14.18 90 top
R208  1002  [R0805]  167.67,11.13 90 top
R209  R_user  [R0805']  113.84,17.73 180 top
R210  104  [R0805]  122.3,51 90 top
R211  104  [R0805]  117.5,47.7 90 top
R212  104  [R0805]  120.1,44.6 90 top
R213  13  [R1206]  167.2,25.8 0 top
R214  2201  [R0805]  170.36,21.6 180 top
R215  100  [R0805]  114.1,33.3 90 top
R216  13  [R1206]  119.1,38.9 0 top
R217  4701  [R0805]  195.43,48.58 180 top
R218  104  [R0805]  179.37,49.99 0 top
R219  100  [R0805]  190.29,32.72 0 top
R220  100  [R0805]  190.29,36.27 180 top
R221  47  [V235/17_1MM]  198.15,75.41 90 bottom
R222  13  [R1206]  152.3,94.46 180 top
R223  47  [V235/17_1MM]  198.15,95.29 90 bottom
R224  104  [R0805]  187.61,97.64 90 top
R225  104  [R0805]  187.61,94.65 90 top
R226  104  [R0805]  187.61,91.48 90 top
R227  4701  [R0805]  167.67,60.68 270 top
R228  1002  [R0805]  172.5,61.19 90 top
R229  1002  [R0805]  153.7,85.95 180 top
R230  1502  [R0805]  149,60.43 0 top
R231  104  [R0805]  148.05,77.06 270 top
R232  104  [R0805]  152.75,77.06 270 top
R233  1502  [R0805]  145.7,69.06 180 top
R234  1002  [R0805]  143.03,70.4 180 top
R235  2201  [R0805]  143.03,74.97 0 top
R236  1002  [R0805]  149.45,74.84 270 top
R237  4701  [R0805]  154.72,81.13 0 top
R238  2702  [R0805]  156.88,60.43 180 top
R239  102  [R0805]  108.36,66.9 270 top
R240  R_user  [R0805']  108.87,66.4 270 bottom
R241  102  [R0805]  157.51,71.6 0 top
R242  (101)  [R0805]  133.51,81.89 270 top
R243  (1000)  [R0805]  143.03,65.76 0 top
R244  102  [R0805]  188.88,75.67 90 top
R245  13  [R1206]  119.16,70.84 180 top
R246  13  [R1206]  122.46,66.52 180 top
R247  2702  [R0805]  151.54,60.43 0 top
R248  4701  [R0805]  173.81,73.38 270 top
R249  100  [R0805]  178.66,80.3 90 top
R250  104  [R0805]  174.53,79.35 270 top
R251  104  [R0805]  178.34,92.43 270 top
R252  (1002)  [R0805]  165.77,96.37 0 top
R253  2702  [R0805]  167.42,87.48 270 top
R254  47  [V235/17_1MM]  192.56,75.92 90 bottom
R255  47  [V235/17_1MM]  192.56,95.8 270 bottom
R256  2702  [R0805]  174.78,94.21 270 top
R257  2201  [R0805]  166.4,81.76 90 top
R258  1002  [R0805]  133,105.64 90 top
R259  1002  [R0805]  178.1,67.28 270 top
R260  102  [R0805]  178.1,70.33 270 top
R261  2702  [R0805]  177.98,73.38 90 top
R262  1002  [R0805]  167.67,66.78 90 top
R263  1002  [R0805]  167.67,63.73 90 top
R264  R_user  [R0805']  113.84,70.33 180 top
R265  104  [R0805]  122.3,103.6 90 top
R266  104  [R0805]  117.5,100.3 90 top
R267  104  [R0805]  120.1,97.2 90 top
R268  13  [R1206]  167.2,78.4 0 top
R269  2201  [R0805]  170.36,74.2 180 top
R270  100  [R0805]  114.1,85.9 90 top
R271  13  [R1206]  119.1,91.5 0 top
R272  4701  [R0805]  195.43,101.18 180 top
R273  104  [R0805]  179.37,102.59 0 top
R274  100  [R0805]  190.29,85.32 0 top
R275  100  [R0805]  190.29,88.87 180 top
R276  47  [V235/17_1MM]  198.15,128.01 90 bottom
R277  13  [R1206]  152.3,147.06 180 top
R278  47  [V235/17_1MM]  198.15,147.89 90 bottom
R279  104  [R0805]  187.61,150.24 90 top
R280  104  [R0805]  187.61,147.25 90 top
R281  104  [R0805]  187.61,144.08 90 top
R282  4701  [R0805]  167.67,113.28 270 top
R283  1002  [R0805]  172.5,113.79 90 top
R284  1002  [R0805]  153.7,138.55 180 top
R285  1502  [R0805]  149,113.03 0 top
R286  104  [R0805]  148.05,129.66 270 top
R287  104  [R0805]  152.75,129.66 270 top
R288  1502  [R0805]  145.7,121.66 180 top
R289  1002  [R0805]  143.03,123 180 top
R290  2201  [R0805]  143.03,127.57 0 top
R291  1002  [R0805]  149.45,127.44 270 top
R292  4701  [R0805]  154.72,133.73 0 top
R293  2702  [R0805]  156.88,113.03 180 top
R294  102  [R0805]  108.36,119.5 270 top
R295  R_user  [R0805']  108.87,119 270 bottom
R296  102  [R0805]  157.51,124.2 0 top
R297  (101)  [R0805]  133.51,134.49 270 top
R298  (1000)  [R0805]  143.03,118.36 0 top
R299  102  [R0805]  188.88,128.27 90 top
R300  13  [R1206]  119.16,123.44 180 top
R301  13  [R1206]  122.46,119.12 180 top
R302  2702  [R0805]  151.54,113.03 0 top
R303  4701  [R0805]  173.81,125.98 270 top
R304  100  [R0805]  178.66,132.9 90 top
R305  104  [R0805]  174.53,131.95 270 top
R306  104  [R0805]  178.34,145.03 270 top
R307  (1002)  [R0805]  165.77,148.97 0 top
R308  2702  [R0805]  167.42,140.08 270 top
R309  47  [V235/17_1MM]  192.56,128.52 90 bottom
R310  47  [V235/17_1MM]  192.56,148.4 270 bottom
R311  2702  [R0805]  174.78,146.81 270 top
R312  2201  [R0805]  166.4,134.36 90 top
R313  1002  [R0805]  133,158.24 90 top
R314  1002  [R0805]  178.1,119.88 270 top
R315  102  [R0805]  178.1,122.93 270 top
R316  2702  [R0805]  177.98,125.98 90 top
R317  1002  [R0805]  167.67,119.38 90 top
R318  1002  [R0805]  167.67,116.33 90 top
R319  R_user  [R0805']  113.84,122.93 180 top
R320  104  [R0805]  122.3,156.2 90 top
R321  104  [R0805]  117.5,152.9 90 top
R322  104  [R0805]  120.1,149.8 90 top
R323  13  [R1206]  167.2,131 0 top
R324  2201  [R0805]  170.36,126.8 180 top
R325  100  [R0805]  114.1,138.5 90 top
R326  13  [R1206]  119.1,144.1 0 top
R327  4701  [R0805]  195.43,153.78 180 top
R328  104  [R0805]  179.37,155.19 0 top
R329  100  [R0805]  190.29,137.92 0 top
R330  100  [R0805]  190.29,141.47 180 top
SJ1  [SJ]  76.24,90.91 180 bottom
SJ2  [SJ]  76.24,143.51 180 bottom
SJ3  [SJ]  172.24,38.31 180 bottom
SJ4  [SJ]  172.24,90.91 180 bottom
SJ5  [SJ]  172.24,143.51 180 bottom
SJ101  [SJ]  76.24,38.31 180 bottom
SJMP  [SJ']  103.18,42.62 180 top
SJMP1  [SJ']  103.18,95.22 180 top
SJMP2  [SJ']  103.18,147.82 180 top
SJMP3  [SJ']  199.18,42.62 180 top
SJMP4  [SJ']  199.18,95.22 180 top
SJMP5  [SJ']  199.18,147.82 180 top
START  TPSB2.0  [B2.0]  93.01,25.61 0 top
START1  TPSB2.0  [B2.0]  93.01,78.21 0 top
START2  TPSB2.0  [B2.0]  93.01,130.81 0 top
START3  TPSB2.0  [B2.0]  189.01,25.61 0 top
START4  TPSB2.0  [B2.0]  189.01,78.21 0 top
START5  TPSB2.0  [B2.0]  189.01,130.81 0 top
TP1  TPSB2.0  [B2.0]  30.27,11.26 0 top
TP2  TPSB2.0  [B2.0]  21.38,11.89 0 top
TP3  TPSB2.0  [B2.0]  27.41,16.34 0 top
TP4  TPSB2.0  [B2.0]  24.87,21.73 0 top
TP5  TPSB2.0  [B2.0]  27.41,27.13 0 top
TP6  TPSB2.0  [B2.0]  24.87,28.72 0 top
TP7  TPSB2.0  [B2.0]  27.73,34.43 0 top
TP8  TPSB2.0  [B2.0]  24.87,35.7 0 top
TP9  TPSB2.0  [B2.0]  30.27,39.51 0 top
TP10  TPSB2.0  [B2.0]  24.87,42.05 0 top
TP11  TPSB2.0  [B2.0]  30.59,46.5 0 top
TP12  TPSB2.0  [B2.0]  35.67,11.26 0 top
TP13  TPSB2.0  [B2.0]  29.51,49.74 0 top
TP14  TPSB2.0  [B2.0]  30.27,63.85 0 top
TP15  TPSB2.0  [B2.0]  21.38,64.49 0 top
TP16  TPSB2.0  [B2.0]  35.67,14.75 0 top
TP17  TPSB2.0  [B2.0]  35.67,18.24 0 top
TP18  TPSB2.0  [B2.0]  29.95,21.73 0 top
TP19  TPSB2.0  [B2.0]  41.06,24.27 0 top
TP20  TPSB2.0  [B2.0]  27.41,68.94 0 top
TP21  TPSB2.0  [B2.0]  30.27,28.72 0 top
TP22  TPSB2.0  [B2.0]  35.67,32.21 0 top
TP23  TPSB2.0  [B2.0]  35.67,36.34 0 top
TP24  TPSB1,27  [B1,27]  40.75,38.24 0 top
TP25  TPSB2.0  [B2.0]  30.33,42.18 0 top
TP26  TPSB2.0  [B2.0]  30.02,36.78 0 top
TP27  TPSB2.0  [B2.0]  24.87,74.33 0 top
TP28  TPSB2.0  [B2.0]  27.41,79.73 0 top
TP29  TPSB2.0  [B2.0]  24.87,81.32 0 top
TP30  TPSB2.0  [B2.0]  27.73,87.03 0 top
TP31  TPSB2.0  [B2.0]  24.87,88.3 0 top
TP32  TPSB2.0  [B2.0]  30.27,92.11 0 top
TP33  TPSB2.0  [B2.0]  24.87,94.65 0 top
TP34  TPSB2.0  [B2.0]  30.59,99.1 0 top
TP35  TPSB2.0  [B2.0]  35.67,67.35 0 top
TP36  TPSB2.0  [B2.0]  35.67,70.84 0 top
TP37  TPSB2.0  [B2.0]  29.95,74.33 0 top
TP38  TPSB2.0  [B2.0]  41.06,76.87 0 top
TP39  TPSB2.0  [B2.0]  30.27,81.32 0 top
TP40  TPSB2.0  [B2.0]  35.67,84.81 0 top
TP41  TPSB2.0  [B2.0]  35.67,88.94 0 top
TP42  TPSB1,27  [B1,27]  40.75,90.84 0 top
TP43  TPSB2.0  [B2.0]  30.33,94.78 0 top
TP44  TPSB2.0  [B2.0]  30.02,89.38 0 top
TP45  TPSB2.0  [B2.0]  35.67,63.85 0 top
TP46  TPSB2.0  [B2.0]  29.51,102.34 0 top
TP47  TPSB2.0  [B2.0]  30.27,116.45 0 top
TP48  TPSB2.0  [B2.0]  21.38,117.09 0 top
TP49  TPSB2.0  [B2.0]  27.41,121.53 0 top
TP50  TPSB2.0  [B2.0]  24.87,126.93 0 top
TP51  TPSB2.0  [B2.0]  27.41,132.33 0 top
TP52  TPSB2.0  [B2.0]  24.87,133.92 0 top
TP53  TPSB2.0  [B2.0]  27.73,139.63 0 top
TP54  TPSB2.0  [B2.0]  24.87,140.9 0 top
TP55  TPSB2.0  [B2.0]  30.27,144.71 0 top
TP56  TPSB2.0  [B2.0]  24.87,147.25 0 top
TP57  TPSB2.0  [B2.0]  30.59,151.7 0 top
TP58  TPSB2.0  [B2.0]  35.67,119.95 0 top
TP59  TPSB2.0  [B2.0]  35.67,123.44 0 top
TP60  TPSB2.0  [B2.0]  29.95,126.93 0 top
TP61  TPSB2.0  [B2.0]  41.06,129.47 0 top
TP62  TPSB2.0  [B2.0]  30.27,133.92 0 top
TP63  TPSB2.0  [B2.0]  35.67,137.41 0 top
TP64  TPSB2.0  [B2.0]  35.67,141.54 0 top
TP65  TPSB1,27  [B1,27]  40.75,143.44 0 top
TP66  TPSB2.0  [B2.0]  30.33,147.38 0 top
TP67  TPSB2.0  [B2.0]  30.02,141.98 0 top
TP68  TPSB2.0  [B2.0]  35.67,116.45 0 top
TP69  TPSB2.0  [B2.0]  29.51,154.94 0 top
TP70  TPSB2.0  [B2.0]  126.27,11.26 0 top
TP71  TPSB2.0  [B2.0]  117.38,11.89 0 top
TP72  TPSB2.0  [B2.0]  123.41,16.34 0 top
TP73  TPSB2.0  [B2.0]  120.87,21.73 0 top
TP74  TPSB2.0  [B2.0]  123.41,27.13 0 top
TP75  TPSB2.0  [B2.0]  120.87,28.72 0 top
TP76  TPSB2.0  [B2.0]  123.73,34.43 0 top
TP77  TPSB2.0  [B2.0]  120.87,35.7 0 top
TP78  TPSB2.0  [B2.0]  126.27,39.51 0 top
TP79  TPSB2.0  [B2.0]  120.87,42.05 0 top
TP80  TPSB2.0  [B2.0]  126.59,46.5 0 top
TP81  TPSB2.0  [B2.0]  131.67,14.75 0 top
TP82  TPSB2.0  [B2.0]  131.67,18.24 0 top
TP83  TPSB2.0  [B2.0]  125.95,21.73 0 top
TP84  TPSB2.0  [B2.0]  137.06,24.27 0 top
TP85  TPSB2.0  [B2.0]  126.27,28.72 0 top
TP86  TPSB2.0  [B2.0]  131.67,32.21 0 top
TP87  TPSB2.0  [B2.0]  131.67,36.34 0 top
TP88  TPSB1,27  [B1,27]  136.75,38.24 0 top
TP89  TPSB2.0  [B2.0]  126.33,42.18 0 top
TP90  TPSB2.0  [B2.0]  126.02,36.78 0 top
TP91  TPSB2.0  [B2.0]  131.67,11.26 0 top
TP92  TPSB2.0  [B2.0]  125.51,49.74 0 top
TP93  TPSB2.0  [B2.0]  126.27,63.85 0 top
TP94  TPSB2.0  [B2.0]  117.38,64.49 0 top
TP95  TPSB2.0  [B2.0]  123.41,68.94 0 top
TP96  TPSB2.0  [B2.0]  120.87,74.33 0 top
TP97  TPSB2.0  [B2.0]  123.41,79.73 0 top
TP98  TPSB2.0  [B2.0]  120.87,81.32 0 top
TP99  TPSB2.0  [B2.0]  123.73,87.03 0 top
TP100  TPSB2.0  [B2.0]  120.87,88.3 0 top
TP101  TPSB2.0  [B2.0]  126.27,92.11 0 top
TP102  TPSB2.0  [B2.0]  120.87,94.65 0 top
TP103  TPSB2.0  [B2.0]  126.59,99.1 0 top
TP104  TPSB2.0  [B2.0]  131.67,67.35 0 top
TP105  TPSB2.0  [B2.0]  131.67,70.84 0 top
TP106  TPSB2.0  [B2.0]  125.95,74.33 0 top
TP107  TPSB2.0  [B2.0]  137.06,76.87 0 top
TP108  TPSB2.0  [B2.0]  126.27,81.32 0 top
TP109  TPSB2.0  [B2.0]  131.67,84.81 0 top
TP110  TPSB2.0  [B2.0]  131.67,88.94 0 top
TP111  TPSB1,27  [B1,27]  136.75,90.84 0 top
TP112  TPSB2.0  [B2.0]  126.33,94.78 0 top
TP113  TPSB2.0  [B2.0]  126.02,89.38 0 top
TP114  TPSB2.0  [B2.0]  131.67,63.85 0 top
TP115  TPSB2.0  [B2.0]  125.51,102.34 0 top
TP116  TPSB2.0  [B2.0]  126.27,116.45 0 top
TP117  TPSB2.0  [B2.0]  117.38,117.09 0 top
TP118  TPSB2.0  [B2.0]  123.41,121.53 0 top
TP119  TPSB2.0  [B2.0]  120.87,126.93 0 top
TP120  TPSB2.0  [B2.0]  123.41,132.33 0 top
TP121  TPSB2.0  [B2.0]  120.87,133.92 0 top
TP122  TPSB2.0  [B2.0]  123.73,139.63 0 top
TP123  TPSB2.0  [B2.0]  120.87,140.9 0 top
TP124  TPSB2.0  [B2.0]  126.27,144.71 0 top
TP125  TPSB2.0  [B2.0]  120.87,147.25 0 top
TP126  TPSB2.0  [B2.0]  126.59,151.7 0 top
TP127  TPSB2.0  [B2.0]  131.67,119.95 0 top
TP128  TPSB2.0  [B2.0]  131.67,123.44 0 top
TP129  TPSB2.0  [B2.0]  125.95,126.93 0 top
TP130  TPSB2.0  [B2.0]  137.06,129.47 0 top
TP131  TPSB2.0  [B2.0]  126.27,133.92 0 top
TP132  TPSB2.0  [B2.0]  131.67,137.41 0 top
TP133  TPSB2.0  [B2.0]  131.67,141.54 0 top
TP134  TPSB1,27  [B1,27]  136.75,143.44 0 top
TP135  TPSB2.0  [B2.0]  126.33,147.38 0 top
TP136  TPSB2.0  [B2.0]  126.02,141.98 0 top
TP137  TPSB2.0  [B2.0]  131.67,116.45 0 top
TP138  TPSB2.0  [B2.0]  125.51,154.94 0 top
U$1  [CE_10.00]  81.83,6.94 0 bottom
U$2  [CE_10.00]  39.67,27.47 0 top
U$3  [CE_10.00]  81.83,59.54 0 bottom
U$4  [CE_10.00]  39.67,80.07 0 top
U$5  [CE_10.00]  81.83,112.14 0 bottom
U$6  [CE_10.00]  39.67,132.67 0 top
U$7  [CE_10.00]  177.83,6.94 0 bottom
U$8  [CE_10.00]  135.67,27.47 0 top
U$9  [CE_10.00]  177.83,59.54 0 bottom
U$10  [CE_10.00]  135.67,80.07 0 top
U$11  [CE_10.00]  177.83,112.14 0 bottom
U$12  [CE_10.00]  135.67,132.67 0 top
X1  [24-PIN_V2]  76.56,83.1 270 bottom
X2  22-23-2051  [22-23-2051]  26.78,107.03 180 bottom
X3  22-23-2021  [22-23-2021]  16.93,65.76 90 bottom
X4  [24-PIN_V2]  76.56,135.7 270 bottom
X5  22-23-2051  [22-23-2051]  26.78,159.63 180 bottom
X6  22-23-2021  [22-23-2021]  16.93,118.36 90 bottom
X7  [24-PIN_V2]  172.56,30.5 270 bottom
X8  22-23-2051  [22-23-2051]  122.78,54.44 180 bottom
X9  22-23-2021  [22-23-2021]  112.94,13.16 90 bottom
X10  [24-PIN_V2]  172.56,83.1 270 bottom
X11  22-23-2051  [22-23-2051]  122.78,107.03 180 bottom
X12  22-23-2021  [22-23-2021]  112.94,65.76 90 bottom
X13  [24-PIN_V2]  172.56,135.7 270 bottom
X14  22-23-2051  [22-23-2051]  122.78,159.63 180 bottom
X15  22-23-2021  [22-23-2021]  112.94,118.36 90 bottom
X101  [24-PIN_V2]  76.56,30.5 270 bottom
X102  22-23-2021  [22-23-2021]  16.93,13.16 90 bottom
X103  22-23-2051  [22-23-2051]  26.78,54.44 180 bottom

## Tracks (layer width: path | path; a pad name or v marks a point on that pad's centre or on a via)
+10V  (via drill 0.6)  (17 unrouted)
  Top 0.406: 78.53,49.35 76.12,51.77 IC111.3 76.12,54.7 75.75,55.07 73.97,55.07 73.72,54.82 73.72,53.58 IC111.5 | 78.66,49.23 IC111.16 | 76.88,43.39 77.89,42.5 R145.2 | 75.36,49.35 75.23,49.35 74.85,48.97 IC111.13 74.85,45.55 75.61,44.91 76.88,43.77 76.88,43.39 | 75.36,49.35 78.53,49.35 | 78.53,49.35 78.66,49.23 | IC110.4 71.42,41.35 72.43,40.34 v72.94,40.34 74.09,40.34 75.23,39.2 IC110.8 | 78.66,49.23 82.2,48.99 83.89,48.99 85.4,50.5 90.73,50.5 91.5,49.99 93.79,49.99 94.3,49.48 94.3,43.89 94.47,43.13 94.47,42.58 IC104.1 | v77.64,43.26 76.88,43.26 76.88,43.39 | 75.36,49.35 76.12,51.13 76.12,51.51 76.24,51.51 | R10.2 83.37,47.26 C102.1 | 78.53,101.95 76.12,104.37 IC7.3 76.12,107.3 75.75,107.67 73.97,107.67 73.72,107.42 73.72,106.18 IC7.5 | 78.66,101.83 IC7.16 | 76.88,95.99 77.89,95.1 R47.2 | 75.36,101.95 75.23,101.95 74.85,101.57 IC7.13 74.85,98.14 75.61,97.51 76.88,96.37 76.88,95.99 | 75.36,101.95 78.53,101.95 | 78.53,101.95 78.66,101.83 | IC6.4 71.42,93.95 72.43,92.94 v72.94,92.94 74.09,92.94 75.23,91.8 IC6.8 | 78.66,101.83 82.2,101.59 83.89,101.59 85.4,103.1 90.73,103.1 91.5,102.59 93.79,102.59 94.3,102.08 94.3,96.49 94.47,95.73 94.47,95.18 IC8.1 | v77.64,95.86 76.88,95.86 76.88,95.99 | 75.36,101.95 76.12,103.73 76.12,104.11 76.24,104.11 | R64.2 83.37,99.86 C9.1 | 78.53,154.56 76.12,156.97 IC16.3 76.12,159.9 75.75,160.27 73.97,160.27 73.72,160.02 73.72,158.78 IC16.5 | 78.66,154.43 IC16.16 | 76.88,148.59 77.89,147.7 R139.2 | 75.36,154.56 75.23,154.56 74.85,154.17 IC16.13 74.85,150.75 75.61,150.11 76.88,148.97 76.88,148.59 | 75.36,154.56 78.53,154.56 | 78.53,154.56 78.66,154.43
  Top 0.406: IC15.4 71.42,146.55 72.43,145.54 v72.94,145.54 74.09,145.54 75.23,144.4 IC15.8 | 78.66,154.43 82.2,154.19 83.89,154.19 85.4,155.7 90.73,155.7 91.5,155.19 93.79,155.19 94.3,154.68 94.3,149.09 94.47,148.33 94.47,147.78 IC17.1 | v77.64,148.46 76.88,148.46 76.88,148.59 | 75.36,154.56 76.12,156.33 76.12,156.71 76.24,156.71 | R163.2 83.37,152.46 C22.1 | 174.53,49.35 172.12,51.77 IC25.3 172.12,54.7 171.75,55.07 169.97,55.07 169.72,54.82 169.72,53.58 IC25.5 | 174.66,49.23 IC25.16 | 172.88,43.39 173.89,42.5 R201.2 | 171.35,49.35 171.23,49.35 170.85,48.97 IC25.13 170.85,45.55 171.61,44.91 172.88,43.77 172.88,43.39 | 171.35,49.35 174.53,49.35 | 174.53,49.35 174.66,49.23 | IC24.4 167.42,41.35 168.43,40.34 v168.94,40.34 170.08,40.34 171.23,39.2 IC24.8 | 174.66,49.23 178.2,48.99 179.89,48.99 181.4,50.5 186.73,50.5 187.5,49.99 189.79,49.99 190.3,49.48 190.3,43.89 190.47,43.13 190.47,42.58 IC26.1 | v173.64,43.26 172.88,43.26 172.88,43.39 | 171.35,49.35 172.12,51.13 172.12,51.51 172.24,51.51 | R218.2 179.37,47.26 C34.1 | 174.53,101.95 172.12,104.37 IC34.3 172.12,107.3 171.75,107.67 169.97,107.67 169.72,107.42 169.72,106.18 IC34.5 | 174.66,101.83 IC34.16 | 172.88,95.99 173.89,95.1 R256.2 | 171.35,101.95 171.23,101.95 170.85,101.57 IC34.13 170.85,98.14 171.61,97.51 172.88,96.37 172.88,95.99 | 171.35,101.95 174.53,101.95 | 174.53,101.95 174.66,101.83 | IC33.4 167.42,93.95 168.43,92.94 v168.94,92.94 170.08,92.94 171.23,91.8 IC33.8 | 174.66,101.83 178.2,101.59 179.89,101.59 181.4,103.1 186.73,103.1 187.5,102.59 189.79,102.59 190.3,102.08 190.3,96.49 190.47,95.73 190.47,95.18 IC35.1
  Top 0.406: v173.64,95.86 172.88,95.86 172.88,95.99 | 171.35,101.95 172.12,103.73 172.12,104.11 172.24,104.11 | R273.2 179.37,99.86 C46.1 | 174.53,154.56 172.12,156.97 IC43.3 172.12,159.9 171.75,160.27 169.97,160.27 169.72,160.02 169.72,158.78 IC43.5 | 174.66,154.43 IC43.16 | 172.88,148.59 173.89,147.7 R311.2 | 171.35,154.56 171.23,154.56 170.85,154.17 IC43.13 170.85,150.75 171.61,150.11 172.88,148.97 172.88,148.59 | 171.35,154.56 174.53,154.56 | 174.53,154.56 174.66,154.43 | IC42.4 167.42,146.55 168.43,145.54 v168.94,145.54 170.08,145.54 171.23,144.4 IC42.8 | 174.66,154.43 178.2,154.19 179.89,154.19 181.4,155.7 186.73,155.7 187.5,155.19 189.79,155.19 190.3,154.68 190.3,149.09 190.47,148.33 190.47,147.78 IC44.1 | v173.64,148.46 172.88,148.46 172.88,148.59 | 171.35,154.56 172.12,156.33 172.12,156.71 172.24,156.71 | R328.2 179.37,152.46 C58.1
  Bottom 0.406: v77.64,43.26 77.64,42.5 75.48,40.34 v72.94,40.34 | v77.64,95.86 77.64,95.1 75.48,92.94 v72.94,92.94 | v77.64,148.46 77.64,147.7 75.48,145.54 v72.94,145.54 | v173.64,43.26 173.64,42.5 171.48,40.34 v168.94,40.34 | v173.64,95.86 173.64,95.1 171.48,92.94 v168.94,92.94 | v173.64,148.46 173.64,147.7 171.48,145.54 v168.94,145.54
  pour Top: 73.58,51.77 81.34,51.77 81.58,51.51 81.83,51.26 82.1,50.75 82.09,48.34 79.67,48.34 79.29,48.72 73.7,48.72 73.7,51.64
  pour Top: 73.58,104.37 81.34,104.37 81.58,104.11 81.83,103.86 82.1,103.35 82.09,100.94 79.67,100.94 79.29,101.32 73.7,101.32 73.7,104.24
  pour Top: 73.58,156.97 81.34,156.97 81.58,156.71 81.83,156.46 82.1,155.95 82.09,153.54 79.67,153.54 79.29,153.92 73.7,153.92 73.7,156.84
  pour Top: 169.58,51.77 177.34,51.77 177.58,51.51 177.83,51.26 178.1,50.75 178.09,48.34 175.67,48.34 175.29,48.72 169.7,48.72 169.7,51.64
  pour Top: 169.58,104.37 177.34,104.37 177.58,104.11 177.83,103.86 178.1,103.35 178.09,100.94 175.67,100.94 175.29,101.32 169.7,101.32 169.7,104.24
  pour Top: 169.58,156.97 177.34,156.97 177.58,156.71 177.83,156.46 178.1,155.95 178.09,153.54 175.67,153.54 175.29,153.92 169.7,153.92 169.7,156.84
+12V  (via drill 0.5, 0.6)  (23 unrouted)
  Top 0.35: 20,21.67 20.11,21.16 | 20,74.27 20.11,73.76 | 20,126.87 20.11,126.36 | 116,21.67 116.11,21.16 | 116,74.27 116.11,73.76 | 116,126.87 116.11,126.36
  Top 0.406: IC105.16 18.2,49.86 v18.2,52.66 | R102.1 26.71,14.81 25.95,15.57 R106.1 v25.44,19.76 21.51,19.76 20.11,21.16 | IC102.3 44.98,7.85 43.73,9.1 | R135.1 79.42,27.77 78.02,28.53 | IC107.9 19.37,22.43 20,21.67 | IC1.16 18.2,102.46 v18.2,105.26 | R37.1 26.71,67.41 25.95,68.17 R36.1 v25.44,72.36 21.51,72.36 20.11,73.76 | IC5.3 44.98,60.45 43.73,61.7 | R41.1 79.42,80.36 78.02,81.13 | IC3.9 19.37,75.03 20,74.27 | IC10.16 18.2,155.06 v18.2,157.86 | R92.1 26.71,120.01 25.95,120.77 R91.1 v25.44,124.96 21.51,124.96 20.11,126.36 | IC14.3 44.98,113.05 43.73,114.3 | R96.1 79.42,132.97 78.02,133.73 | IC12.9 19.37,127.63 20,126.87 | IC19.16 114.2,49.86 v114.2,52.66 | R191.1 122.71,14.81 121.95,15.57 R190.1 v121.44,19.76 117.51,19.76 116.11,21.16 | IC23.3 140.98,7.85 139.73,9.1 | R195.1 175.42,27.77 174.02,28.53 | IC21.9 115.37,22.43 116,21.67 | IC28.16 114.2,102.46 v114.2,105.26 | R246.1 122.71,67.41 121.95,68.17 R245.1 v121.44,72.36 117.51,72.36 116.11,73.76 | IC32.3 140.98,60.45 139.73,61.7 | R250.1 175.42,80.36 174.02,81.13 | IC30.9 115.37,75.03 116,74.27 | IC37.16 114.2,155.06 v114.2,157.86 | R301.1 122.71,120.01 121.95,120.77 R300.1 v121.44,124.96 117.51,124.96 116.11,126.36 | IC41.3 140.98,113.05 139.73,114.3 | R305.1 175.42,132.97 174.02,133.73 | IC39.9 115.37,127.63 116,126.87